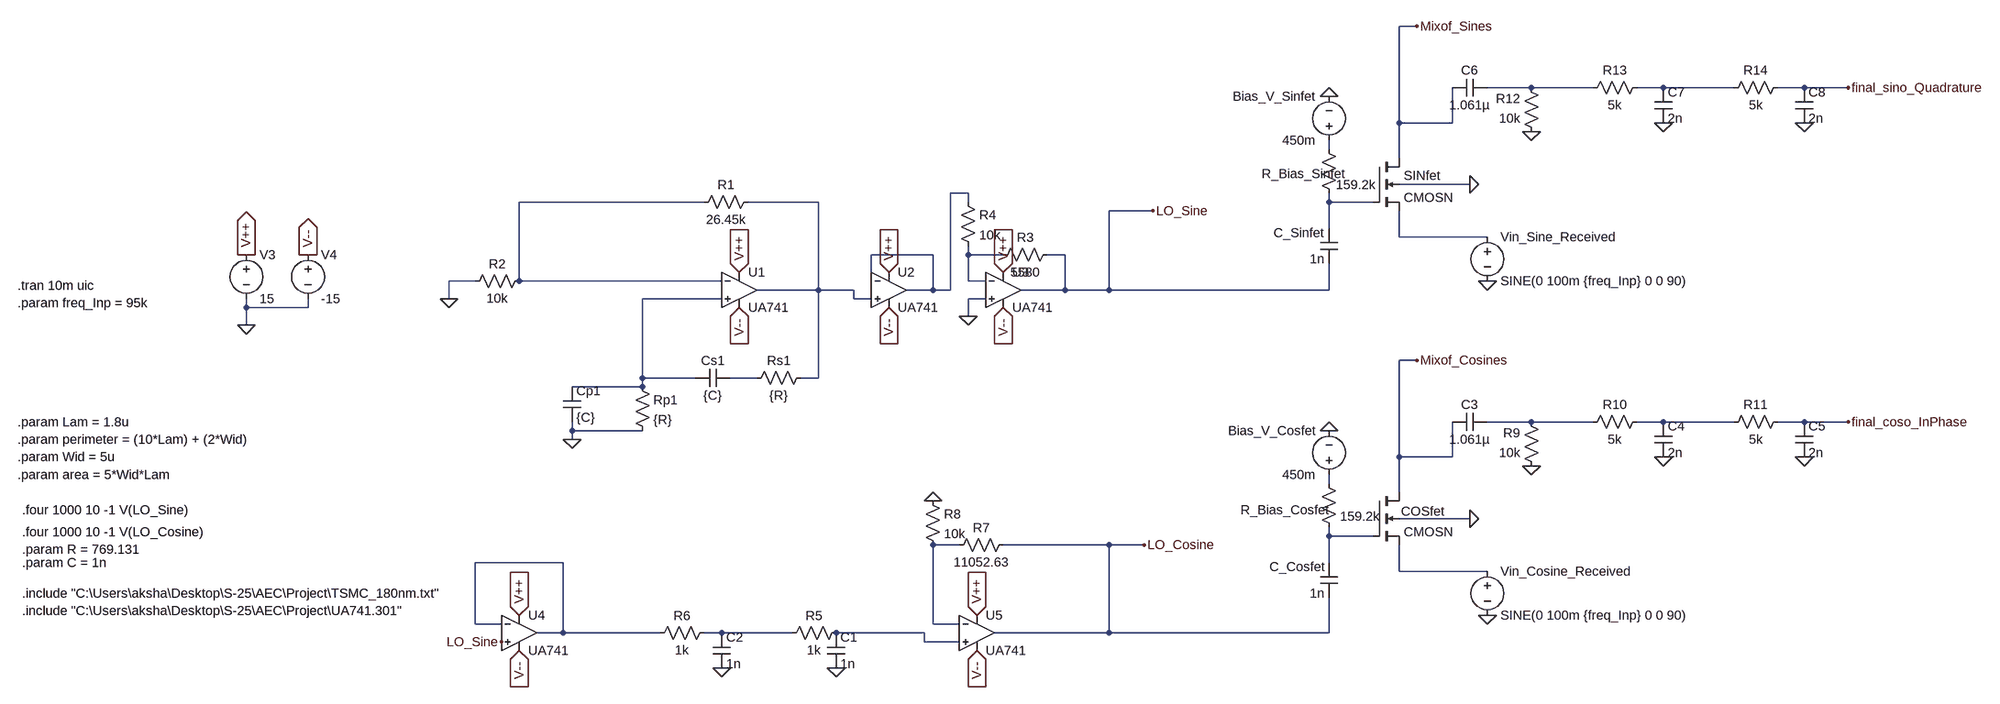
[diagram p0: schematic Draft2.asc]
Draft2.asc, the LTspice schematic file:
Version 4
SHEET 1 2704 784
WIRE 624 -448 592 -448
WIRE 832 -336 752 -336
WIRE 944 -336 832 -336
WIRE 1072 -336 1024 -336
WIRE 1200 -336 1072 -336
WIRE 1328 -336 1280 -336
WIRE 1408 -336 1328 -336
WIRE 592 -272 592 -448
WIRE 688 -272 688 -336
WIRE 688 -272 592 -272
WIRE 464 -224 464 -240
WIRE 592 -208 592 -272
WIRE 720 -160 592 -160
WIRE -192 -144 -224 -144
WIRE -672 -128 -1008 -128
WIRE -464 -128 -592 -128
WIRE -192 -128 -192 -144
WIRE 464 -128 464 -144
WIRE 544 -128 464 -128
WIRE 144 -112 64 -112
WIRE 464 -80 464 -128
WIRE 592 -64 592 -112
WIRE 752 -64 592 -64
WIRE -256 -32 -368 -32
WIRE -192 -32 -192 -48
WIRE -128 -32 -192 -32
WIRE -16 -32 -48 -32
WIRE -1088 16 -1136 16
WIRE -1008 16 -1008 -128
WIRE -640 16 -1008 16
WIRE -368 16 -368 -32
WIRE -192 16 -192 -32
WIRE -160 16 -192 16
WIRE -464 32 -464 -128
WIRE -464 32 -576 32
WIRE -400 32 -464 32
WIRE -256 32 -256 -32
WIRE -256 32 -304 32
WIRE -224 32 -224 -144
WIRE -224 32 -256 32
WIRE -16 32 -16 -32
WIRE -16 32 -96 32
WIRE 64 32 64 -112
WIRE 64 32 -16 32
WIRE 464 32 464 -16
WIRE 464 32 64 32
WIRE -1136 48 -1136 16
WIRE -640 48 -784 48
WIRE -400 48 -400 32
WIRE -368 48 -400 48
WIRE -160 48 -192 48
WIRE -1504 64 -1504 48
WIRE -1392 64 -1392 48
WIRE -1392 64 -1504 64
WIRE -192 80 -192 48
WIRE -1504 96 -1504 64
WIRE 624 160 592 160
WIRE -784 192 -784 48
WIRE -688 192 -784 192
WIRE -576 192 -624 192
WIRE -464 192 -464 32
WIRE -464 192 -496 192
WIRE -784 208 -784 192
WIRE -784 208 -912 208
WIRE 832 272 752 272
WIRE 944 272 832 272
WIRE 1072 272 1024 272
WIRE 1200 272 1072 272
WIRE 1328 272 1280 272
WIRE 1408 272 1328 272
WIRE -912 288 -912 272
WIRE -784 288 -912 288
WIRE -912 304 -912 288
WIRE 592 336 592 160
WIRE 688 336 688 272
WIRE 688 336 592 336
WIRE 464 384 464 368
WIRE 592 400 592 336
WIRE 720 448 592 448
WIRE 464 480 464 464
WIRE 544 480 464 480
WIRE -208 496 -256 496
WIRE 64 496 -128 496
WIRE 128 496 64 496
WIRE -928 528 -1088 528
WIRE 464 528 464 480
WIRE 592 544 592 496
WIRE 752 544 592 544
WIRE -1088 640 -1088 528
WIRE -1040 640 -1088 640
WIRE -256 640 -256 496
WIRE -208 640 -256 640
WIRE -928 656 -928 528
WIRE -928 656 -976 656
WIRE -752 656 -928 656
WIRE -640 656 -672 656
WIRE -512 656 -640 656
WIRE -272 656 -432 656
WIRE 64 656 64 496
WIRE 64 656 -144 656
WIRE 464 656 464 592
WIRE 464 656 64 656
WIRE -272 672 -272 656
WIRE -208 672 -272 672
FLAG -608 0 V++
IOPIN -608 0 In
FLAG -608 64 V--
IOPIN -608 64 In
FLAG -912 304 0
FLAG -1136 48 0
FLAG 144 -112 LO_Sine
FLAG -1504 96 0
FLAG -1504 -32 V++
IOPIN -1504 -32 Out
FLAG -1392 -32 V--
IOPIN -1392 -32 Out
FLAG -336 0 V++
IOPIN -336 0 In
FLAG -336 64 V--
IOPIN -336 64 In
FLAG -128 0 V++
IOPIN -128 0 In
FLAG -128 64 V--
IOPIN -128 64 In
FLAG -192 80 0
FLAG -1008 624 V++
IOPIN -1008 624 In
FLAG -1008 688 V--
IOPIN -1008 688 In
FLAG -1040 672 LO_Sine
FLAG -432 720 0
FLAG -640 720 0
FLAG -176 624 V++
IOPIN -176 624 In
FLAG -176 688 V--
IOPIN -176 688 In
FLAG -256 416 0
FLAG 128 496 LO_Cosine
FLAG 464 288 0
FLAG 752 624 0
FLAG 720 448 0
FLAG 624 160 Mixof_Cosines
FLAG 1408 272 final_coso_InPhase
FLAG 1072 336 0
FLAG 832 352 0
FLAG 1328 336 0
FLAG 464 -320 0
FLAG 752 16 0
FLAG 720 -160 0
FLAG 624 -448 Mixof_Sines
FLAG 1408 -336 final_sino_Quadrature
FLAG 1072 -272 0
FLAG 832 -256 0
FLAG 1328 -272 0
SYMBOL OpAmps\\opamp2 -608 -32 R0
SYMATTR InstName U1
SYMATTR Value UA741
SYMBOL cap -928 208 R0
SYMATTR InstName Cp1
SYMATTR Value {C}
SYMBOL cap -624 176 R90
WINDOW 0 0 32 VBottom 2
WINDOW 3 32 32 VTop 2
SYMATTR InstName Cs1
SYMATTR Value {C}
SYMBOL res -800 192 R0
SYMATTR InstName Rp1
SYMATTR Value {R}
SYMBOL res -480 176 R90
WINDOW 0 0 56 VBottom 2
WINDOW 3 32 56 VTop 2
SYMATTR InstName Rs1
SYMATTR Value {R}
SYMBOL res -576 -144 R90
WINDOW 0 0 56 VBottom 2
WINDOW 3 32 56 VTop 2
SYMATTR InstName R1
SYMATTR Value 26.45k
SYMBOL res -992 0 R90
WINDOW 0 0 56 VBottom 2
WINDOW 3 32 56 VTop 2
SYMATTR InstName R2
SYMATTR Value 10k
SYMBOL voltage -1504 -48 R0
WINDOW 123 0 0 Left 0
WINDOW 39 0 0 Left 0
SYMATTR InstName V3
SYMATTR Value 15
SYMBOL voltage -1392 -48 R0
WINDOW 123 0 0 Left 0
WINDOW 39 0 0 Left 0
SYMATTR InstName V4
SYMATTR Value -15
SYMBOL OpAmps\\opamp2 -336 -32 R0
SYMATTR InstName U2
SYMATTR Value UA741
SYMBOL OpAmps\\opamp2 -128 -32 R0
SYMATTR InstName U3
SYMATTR Value UA741
SYMBOL res -32 -48 R90
WINDOW 0 0 56 VBottom 2
WINDOW 3 32 56 VTop 2
SYMATTR InstName R3
SYMATTR Value 5580
SYMBOL res -208 -144 R0
SYMATTR InstName R4
SYMATTR Value 10k
SYMBOL OpAmps\\opamp2 -1008 592 R0
SYMATTR InstName U4
SYMATTR Value UA741
SYMBOL res -416 640 R90
WINDOW 0 0 56 VBottom 2
WINDOW 3 32 56 VTop 2
SYMATTR InstName R5
SYMATTR Value 1k
SYMBOL cap -448 656 R0
SYMATTR InstName C1
SYMATTR Value 1n
SYMBOL res -656 640 R90
WINDOW 0 0 56 VBottom 2
WINDOW 3 32 56 VTop 2
SYMATTR InstName R6
SYMATTR Value 1k
SYMBOL cap -656 656 R0
SYMATTR InstName C2
SYMATTR Value 1n
SYMBOL OpAmps\\opamp2 -176 592 R0
SYMATTR InstName U5
SYMATTR Value UA741
SYMBOL res -112 480 R90
WINDOW 0 0 56 VBottom 2
WINDOW 3 32 56 VTop 2
SYMATTR InstName R7
SYMATTR Value 11052.63
SYMBOL res -272 400 R0
SYMATTR InstName R8
SYMATTR Value 10k
SYMBOL cap 480 592 R180
WINDOW 0 24 56 Left 2
WINDOW 3 24 8 Left 2
SYMATTR InstName C_Cosfet
SYMATTR Value 1n
SYMBOL res 448 368 R0
WINDOW 0 -145 64 Left 2
SYMATTR InstName R_Bias_Cosfet
SYMATTR Value 159.2k
SYMBOL voltage 464 384 R180
WINDOW 0 24 96 Left 2
WINDOW 3 24 16 Left 2
WINDOW 123 0 0 Left 0
WINDOW 39 0 0 Left 0
SYMATTR InstName Bias_V_Cosfet
SYMATTR Value 450m
SYMBOL nmos4 544 400 R0
WINDOW 0 51 35 Left 2
SYMATTR InstName COSfet
SYMATTR Value CMOSN
SYMATTR Value2 l={2*Lam} w={1*Wid} ad={5*Wid*Lam} as={5*Wid*Lam} pd={perimeter} ps={perimeter}
SYMBOL voltage 752 528 R0
WINDOW 123 0 0 Left 0
WINDOW 39 0 0 Left 0
SYMATTR InstName Vin_Cosine_Received
SYMATTR Value SINE(0 100m {freq_Inp} 0 0 90)
SYMBOL res 848 368 R180
WINDOW 0 36 76 Left 2
WINDOW 3 36 40 Left 2
SYMATTR InstName R9
SYMATTR Value 10k
SYMBOL cap 752 256 R90
WINDOW 0 0 32 VBottom 2
WINDOW 3 32 32 VTop 2
SYMATTR InstName C3
SYMATTR Value 1.061µ
SYMBOL res 1040 256 R90
WINDOW 0 0 56 VBottom 2
WINDOW 3 32 56 VTop 2
SYMATTR InstName R10
SYMATTR Value 5k
SYMBOL cap 1056 272 R0
SYMATTR InstName C4
SYMATTR Value 2n
SYMBOL res 1296 256 R90
WINDOW 0 0 56 VBottom 2
WINDOW 3 32 56 VTop 2
SYMATTR InstName R11
SYMATTR Value 5k
SYMBOL cap 1312 272 R0
SYMATTR InstName C5
SYMATTR Value 2n
SYMBOL cap 480 -16 R180
WINDOW 0 24 56 Left 2
WINDOW 3 24 8 Left 2
SYMATTR InstName C_Sinfet
SYMATTR Value 1n
SYMBOL res 448 -240 R0
WINDOW 0 -106 61 Left 2
WINDOW 3 29 81 Left 2
SYMATTR InstName R_Bias_Sinfet
SYMATTR Value 159.2k
SYMBOL voltage 464 -224 R180
WINDOW 0 24 96 Left 2
WINDOW 3 24 16 Left 2
WINDOW 123 0 0 Left 0
WINDOW 39 0 0 Left 0
SYMATTR InstName Bias_V_Sinfet
SYMATTR Value 450m
SYMBOL nmos4 544 -208 R0
SYMATTR InstName SINfet
SYMATTR Value CMOSN
SYMATTR Value2 l={2*Lam} w={1*Wid} ad={5*Wid*Lam} as={5*Wid*Lam} pd={perimeter} ps={perimeter}
SYMBOL voltage 752 -80 R0
WINDOW 123 0 0 Left 0
WINDOW 39 0 0 Left 0
SYMATTR InstName Vin_Sine_Received
SYMATTR Value SINE(0 100m {freq_Inp} 0 0 90)
SYMBOL res 848 -240 R180
WINDOW 0 36 76 Left 2
WINDOW 3 36 40 Left 2
SYMATTR InstName R12
SYMATTR Value 10k
SYMBOL cap 752 -352 R90
WINDOW 0 0 32 VBottom 2
WINDOW 3 32 32 VTop 2
SYMATTR InstName C6
SYMATTR Value 1.061µ
SYMBOL res 1040 -352 R90
WINDOW 0 0 56 VBottom 2
WINDOW 3 32 56 VTop 2
SYMATTR InstName R13
SYMATTR Value 5k
SYMBOL cap 1056 -336 R0
SYMATTR InstName C7
SYMATTR Value 2n
SYMBOL res 1296 -352 R90
WINDOW 0 0 56 VBottom 2
WINDOW 3 32 56 VTop 2
SYMATTR InstName R14
SYMATTR Value 5k
SYMBOL cap 1312 -336 R0
SYMATTR InstName C8
SYMATTR Value 2n
TEXT -1912 584 Left 2 !.include "C:\\Users\\aksha\\Desktop\\S-25\\AEC\\Project\\TSMC_180nm.txt"
TEXT -1912 616 Left 2 !.include "C:\\Users\\aksha\\Desktop\\S-25\\AEC\\Project\\UA741.301"
TEXT -1920 24 Left 2 !.tran 10m uic
TEXT -1912 432 Left 2 !.four 1000 10 -1 V(LO_Sine)
TEXT -1912 472 Left 2 !.four 1000 10 -1 V(LO_Cosine)
TEXT -1912 504 Left 2 !.param R = 769.131
TEXT -1912 528 Left 2 !.param C = 1n
TEXT -1920 304 Left 2 !.param perimeter = (10*Lam) + (2*Wid)
TEXT -1920 272 Left 2 !.param Lam = 1.8u
TEXT -1920 336 Left 2 !.param Wid = 5u
TEXT -1920 56 Left 2 !.param freq_Inp = 95k
TEXT -1920 368 Left 2 !.param area = 5*Wid*Lam

The netlist it stands for:
* Draft2.asc
XU1 N010 N005 V++ V-- N006 UA741  ; pins In+ In- V+ V- OUT
Cp1 N010 0 {C}
Cs1 N011 N010 {C}
Rp1 N010 0 {R}
Rs1 N006 N011 {R}
R1 N006 N005 26.45k
R2 N005 0 10k
V3 V++ 0 15
V4 V-- 0 -15
XU2 N006 N004 V++ V-- N004 UA741  ; pins In+ In- V+ V- OUT
XU3 0 N009 V++ V-- LO_Sine UA741  ; pins In+ In- V+ V- OUT
R3 LO_Sine N009 5580
R4 N004 N009 10k
XU4 LO_Sine N017 V++ V-- N017 UA741  ; pins In+ In- V+ V- OUT
R5 N020 N019 1k
C1 N020 0 1n
R6 N019 N017 1k
C2 N019 0 1n
XU5 N020 N016 V++ V-- LO_Cosine UA741  ; pins In+ In- V+ V- OUT
R7 LO_Cosine N016 11052.63
R8 0 N016 10k
C_Cosfet LO_Cosine N015 1n
R_Bias_Cosfet N014 N015 159.2k
V§Bias_V_Cosfet N014 0 450m
M§COSfet Mixof_Cosines N015 N018 0 CMOSN l={2*Lam} w={1*Wid} ad={5*Wid*Lam} as={5*Wid*Lam} pd={perimeter} ps={perimeter}
Vin_Cosine_Received N018 0 SINE(0 100m {freq_Inp} 0 0 90)
R9 0 N012 10k
C3 N012 Mixof_Cosines 1.061µ
R10 N013 N012 5k
C4 N013 0 2n
R11 final_coso_InPhase N013 5k
C5 final_coso_InPhase 0 2n
C_Sinfet LO_Sine N007 1n
R_Bias_Sinfet N003 N007 159.2k
V§Bias_V_Sinfet N003 0 450m
M§SINfet Mixof_Sines N007 N008 0 CMOSN l={2*Lam} w={1*Wid} ad={5*Wid*Lam} as={5*Wid*Lam} pd={perimeter} ps={perimeter}
Vin_Sine_Received N008 0 SINE(0 100m {freq_Inp} 0 0 90)
R12 0 N001 10k
C6 N001 Mixof_Sines 1.061µ
R13 N002 N001 5k
C7 N002 0 2n
R14 final_sino_Quadrature N002 5k
C8 final_sino_Quadrature 0 2n
.model NMOS NMOS
.model PMOS PMOS
.lib standard.mos
.include "C:\Users\aksha\Desktop\S-25\AEC\Project\TSMC_180nm.txt"
.include "C:\Users\aksha\Desktop\S-25\AEC\Project\UA741.301"
.tran 10m uic
.four 1000 10 -1 V(LO_Sine)
.four 1000 10 -1 V(LO_Cosine)
.param R = 769.131
.param C = 1n
.param perimeter = (10*Lam) + (2*Wid)
.param Lam = 1.8u
.param Wid = 5u
.param freq_Inp = 95k
.param area = 5*Wid*Lam
.backanno
.end